# EAGLE design ServoKnob (EAGLE 7.7.0)
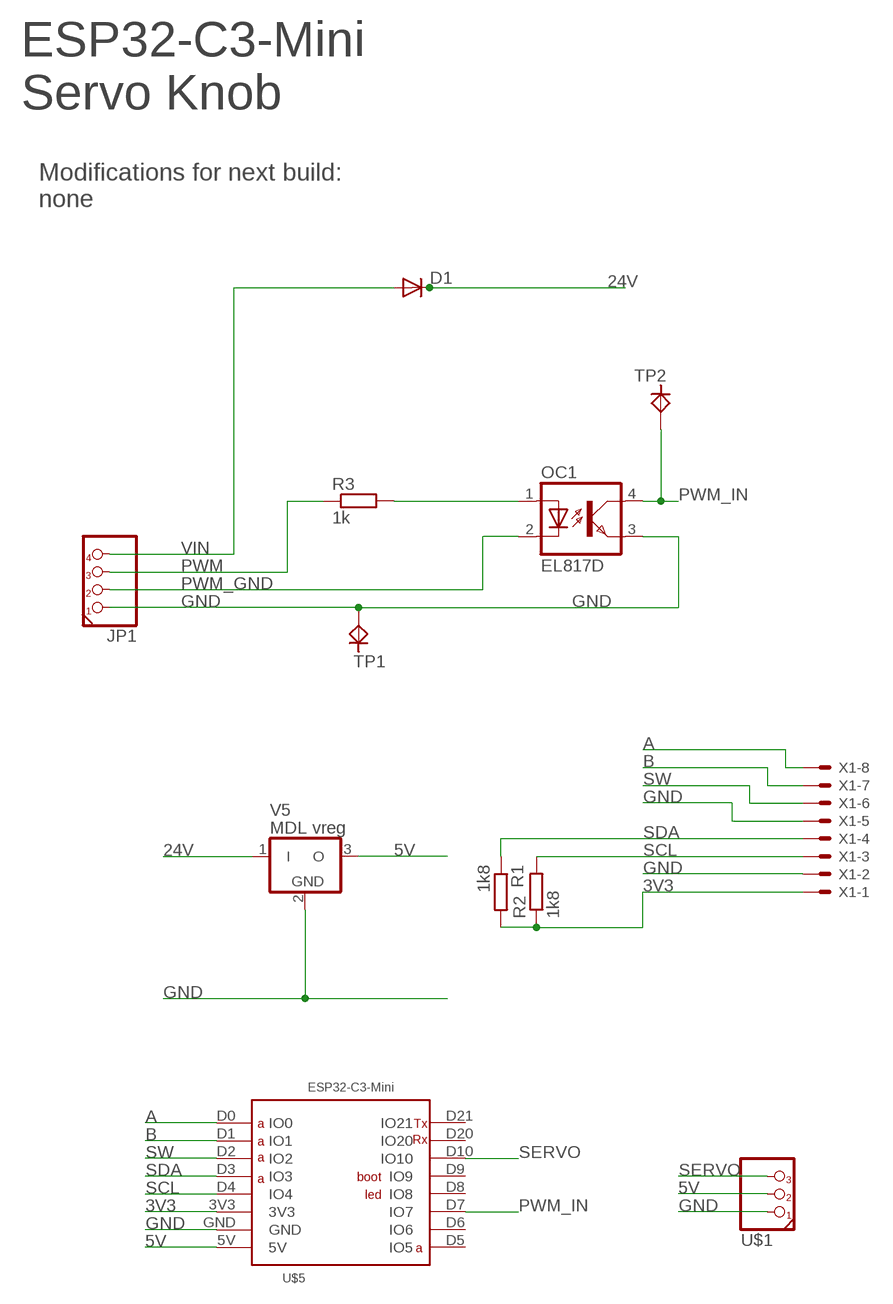
[diagram p0: schematic, sheet 1]

## Parts
D1  DIODE-DO214ACI  [DO214ACI]
JP1  PINHD-1X4PH254  [1X04/PH254]
OC1  EL817D  [DIL04]
R1  1k8  R-EU_R0805  [R0805]
R2  1k8  R-EU_R0805  [R0805]
R3  1k  R-EU_R0805  [R0805]
TP1  TESTPIN-TP10  [TP10]
TP2  TESTPIN-TP10  [TP10]
U$1  PINHD-1X3  [1X03]
U$5  ESP32C3MINIL  [ESP32-C3-MINI]
V5  MDL vreg  VREGMDLSTDWNH  [MDLSTEPDOWNV02H]
X1  JST-XH-08-PIN-L  [JST-XH-08-L]

## Nets
3V3: R1.2 R2.1 U$5.3V3 X1.1
5V: U$1.2 U$5.5V V5.3(O)
24V: D1.C V5.1(I)
A: U$5.D0(IO0) X1.8
B: U$5.D1(IO1) X1.7
GND: JP1.1 OC1.3(EMIT) TP1.TP U$1.1 U$5.GND V5.2(GND) X1.2 X1.5
N$1: OC1.1(A) R3.2
PWM: JP1.3 R3.1
PWM_GND: JP1.2 OC1.2(C)
PWM_IN: OC1.4(COL) TP2.TP U$5.D7(IO7)
SCL: R2.2 U$5.D4(IO4) X1.3
SDA: R1.1 U$5.D3(IO3) X1.4
SERVO: U$1.3 U$5.D10(IO10)
SW: U$5.D2(IO2) X1.6
VIN: D1.A JP1.4
Unconnected: U$5.D5(IO5) U$5.D6(IO6) U$5.D8(IO8) U$5.D9(IO9) U$5.D20(IO20) U$5.D21(IO21)

## Notes on the sheet
- ESP32-C3-Mini
  Servo Knob
- Modifications for next build:
  none

## Library data of the parts
D1 = MyLib:DIODE: DIODE Diode
JP1 = MyLib:PINHD-1X4: PIN HEADER
OC1 = MyLib:EL817: OPTO COUPLER Source: LITEON, LTV816.pdf
R1-R3 = rcl:R-EU_: RESISTOR, European symbol
TP1 TP2 = MyLib:TESTPIN
U$1 = MyLib:PINHD-1X3
U$5 = ESP32:ESP32C3MINI
V5 = MyLib:VREG: 3 terminal voltage regulator PIN-1 input PIN-2 GND PIN-3 Output 78XX,79XX,LP2950
X1 = JST-XH-Pins-Swapped:JST-XH-08-PIN: JST XH Connector 2 Pin Wire to board connector. Pitch: 2,54 mm, (0.100") Number of pins: 8 Created by Rembrandt Electronics www.rembrandtelectronics.com

## Net classes
0 default: width 0.254 mm, clearance 0.254 mm
3 usbvcc: width 0.508 mm, drill 0.61 mm, clearance 0.254 mm

## Board
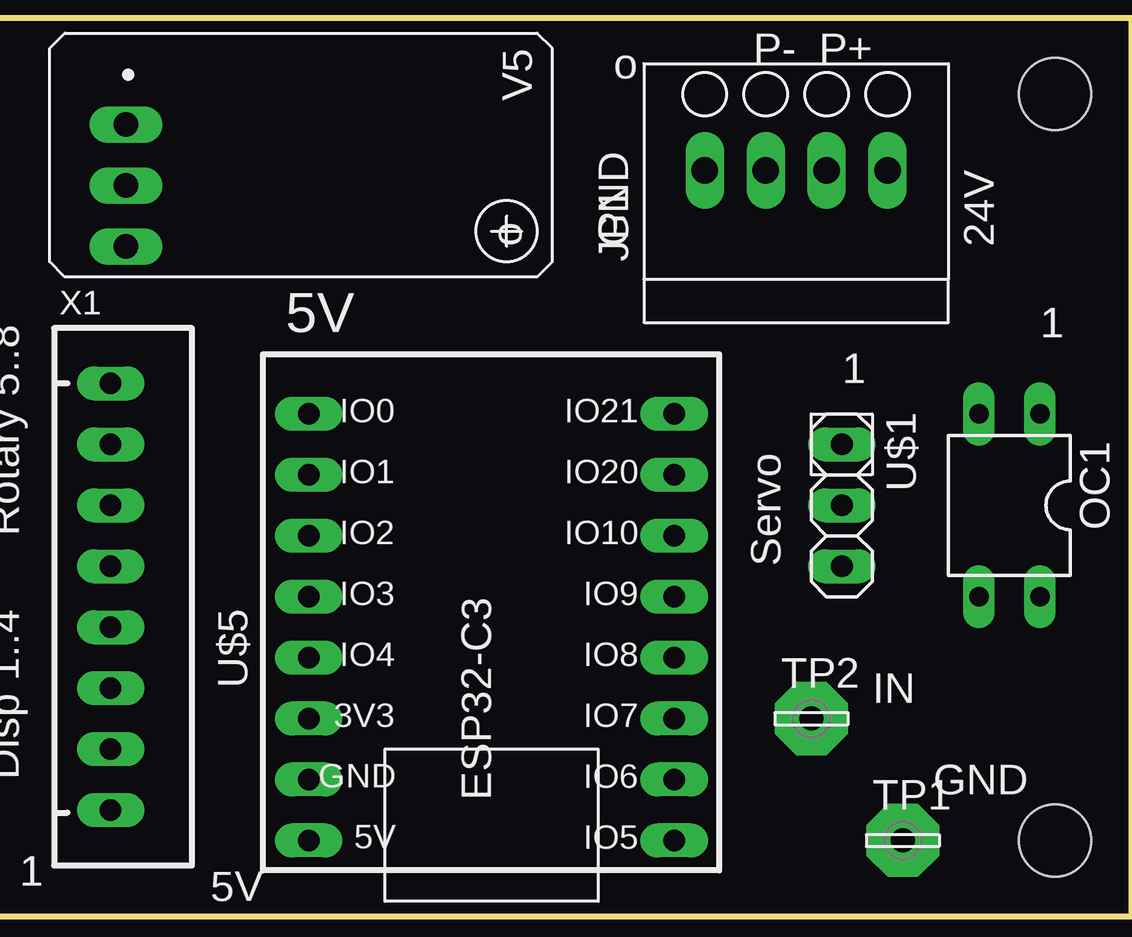
[diagram p1: board, top side]
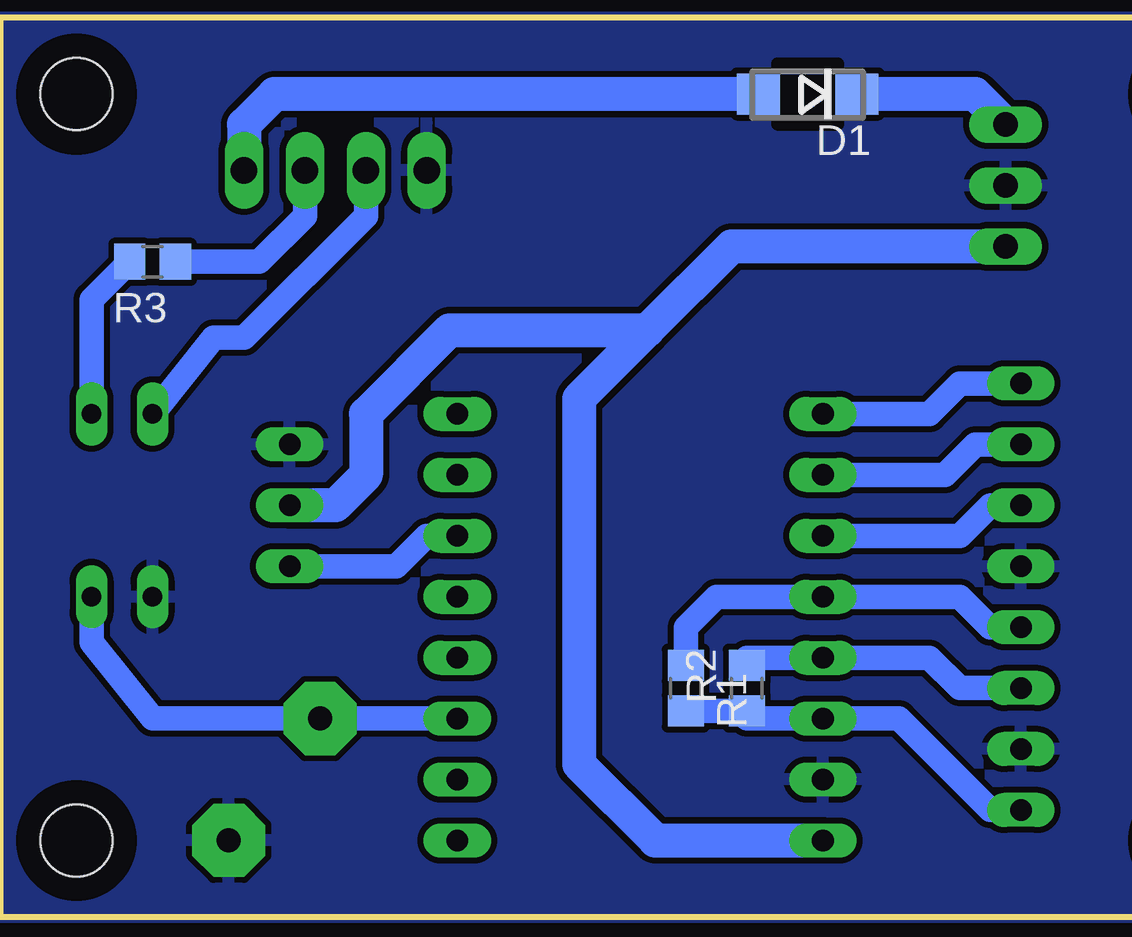
[diagram p2: board, bottom side, seen from below]

No outline drawn. Coordinates in mm, seen from the top.
Copper layers (1*16): Top 0.035mm / dielectric 1.5mm / Bottom 0.035mm
Design rules "default *": minimum track width 10mil, minimum drill 0.6mm, track to track 0.2mm, track to pad 0.2mm, pad to pad 0.2mm, via to via 0.2mm, smd to smd 0.2mm, copper to edge 40mil, drill to drill 8mil, minimum pad ring 10mil, minimum via ring 8mil, stop-mask expansion 4mil, vias tented up to drill 0mil, thermal gap 10mil
Holes 3 mm at 49.53,34.29 49.53,3.17 3.17,34.29 3.17,3.17
Milling: 4 lines

### Footprints (pad centres in the part's own frame; a part is rotated, then mirrored left to right if it is on the bottom)
DO214ACI = smd 1.8 x 1.7: A 2.05,0; C -2.05,0
1X04/PH254 = drill 1.1 long: 1 -3.81,0; 2 -1.27,0; 3 1.27,0; 4 3.81,0
DIL04 = drill 0.813 long: 1 -1.27,-3.81; 2 1.27,-3.81; 3 1.27,3.81; 4 -1.27,3.81
R0805 = smd 1.3 x 1.5: 1 -0.95,0; 2 0.95,0
TP10 = drill 1 pad 3.048 octagon: TP 0,0
1X03 = drill 0.9 long: 1 -2.54,0; 2 0,0; 3 2.54,0
ESP32-C3-MINI = drill 0.9 long: 3V3 -5.08,8.89; 5V -10.16,8.89; D0 7.62,8.89; D1 5.08,8.89; D2 2.54,8.89; D3 0,8.89; D4 -2.54,8.89; D5 -10.16,-6.35; D6 -7.62,-6.35; D7 -5.08,-6.35; D8 -2.54,-6.35; D9 0,-6.35; D10 2.54,-6.35; D20 5.08,-6.35; D21 7.62,-6.35; GND -7.62,8.89
MDLSTEPDOWNV02H = drill 1.016 long: 1 0,0; 2 2.54,0; 3 5.08,0
JST-XH-08-L = drill 0.9 long: 1 8.89,0; 2 6.35,0; 3 3.81,0; 4 1.27,0; 5 -1.27,0; 6 -3.81,0; 7 -6.35,0; 8 -8.89,0

### Placement (x,y rotation side)
D1  19.05,34.29 180 bottom
JP1  38.73,31.11 0 top
OC1  47.62,17.14 180 top
R1  24.13,9.53 270 bottom
R2  21.59,9.53 90 bottom
R3  46.35,27.3 180 bottom
TP1  43.18,3.17 0 top
TP2  39.37,8.26 0 top
U$1  40.64,17.14 270 top
U$5  27.3,13.34 90 top
V5  10.79,33.02 270 top
X1  10.16,13.34 270 top

### Tracks (layer width: path | path; a pad name or v marks a point on that pad's centre or on a via)
3V3
  Bottom 1.016: X1.1 11.43,4.45 15.24,8.26 U$5.3V3 21.59,8.26 R2.1 R1.2
5V
  Bottom 1.422: U$5.5V 25.4,3.17 28.57,6.35 28.57,21.59 25.72,24.45 | V5.3 22.23,27.94 25.72,24.45 | 25.72,24.45 33.97,24.45 37.47,20.95 37.47,18.41 38.73,17.14 U$1.2
24V
  Bottom 1.422: V5.1 12.06,34.29 D1.C
A
  Bottom 1.016: X1.8 12.7,22.23 13.97,20.95 U$5.D0
B
  Bottom 1.016: X1.7 12.06,19.68 13.34,18.41 U$5.D1
GND
  pour Bottom (isolate 0.25): 0,0 0,37.47 52.7,37.47 52.7,0
N$1
  Bottom 1.016: R3.2 48.9,25.71 OC1.1
PWM
  Bottom 1.016: JP1.3 40.01,29.21 41.91,27.3 R3.1
PWM_GND
  Bottom 1.016: JP1.2 37.47,29.21 42.55,24.13 43.81,24.13 OC1.2
PWM_IN
  Bottom 1.016: OC1.4 48.9,11.43 46.35,8.26 TP2.TP U$5.D7
SCL
  Bottom 1.016: X1.3 12.7,9.53 13.97,10.79 U$5.D4 21.59,10.79 R2.2
SDA
  Bottom 1.016: X1.4 11.43,12.06 12.7,13.34 U$5.D3 22.86,13.34 24.13,12.06 R1.1
SERVO
  Bottom 1.016: U$5.D10 34.92,15.88 36.2,14.61 U$1.3
SW
  Bottom 1.016: X1.6 11.43,17.14 12.7,15.88 U$5.D2
VIN
  Bottom 1.422: D1.A 41.27,34.29 42.55,33.02 JP1.4

### Text on the board
_tsilk: P- | P+ | o | o | GND | 24V | 5V | 1 | 1 | ESP32-C3 Mini Servo Knob | Rotary 5..8 | Servo | ESP32-C3 | IN | Disp 1..4 | GND | 5V | 1